# EAGLE design DALI_Master (EAGLE 6.2)
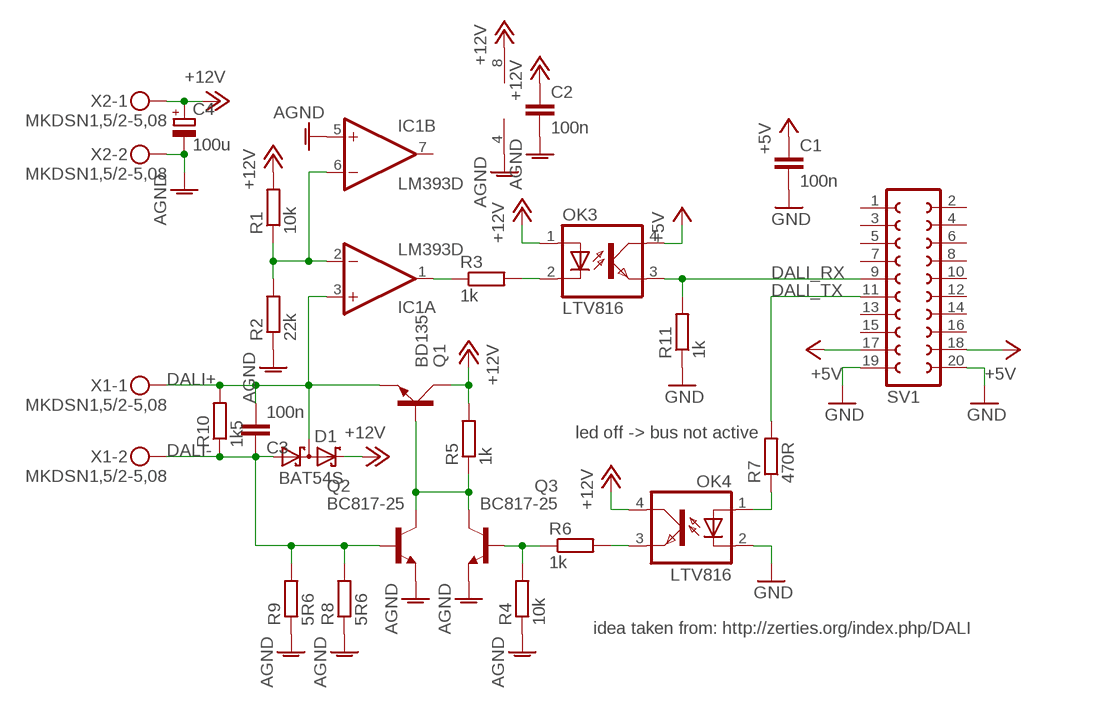
[diagram p0: schematic, sheet 1]

## Parts
C1  100n  C-EUC0805  [C0805]
C2  100n  C-EUC0805  [C0805]
C3  100n  C-EUC0805  [C0805]
C4  100u  CPOL-EUE2.5-6  [E2,5-6]
D1  BAT54S  [SOT23]
IC1  LM393D  [SO08]
OK3  LTV816  [DIL04]
OK4  LTV816  [DIL04]
Q1  BD135  BD139  [TO126AV]
Q2  BC817-25  BC817-25SMD  [SOT23-BEC]
Q3  BC817-25  BC817-25SMD  [SOT23-BEC]
R1  10k  R-EU_R0805  [R0805]
R2  22k  R-EU_R0805  [R0805]
R3  1k  R-EU_R0805  [R0805]
R4  10k  R-EU_R0805  [R0805]
R5  1k  R-EU_R0805  [R0805]
R6  1k  R-EU_R0805  [R0805]
R7  470R  R-EU_R0805  [R0805]
R8  5R6  R-EU_R1206  [R1206]
R9  5R6  R-EU_R1206  [R1206]
R10  1k5  R-EU_R0805  [R0805]
R11  1k  R-EU_R0805  [R0805]
SV1  FE10-2  [FE10-2]
X1  MKDSN1,5/2-5,08  [MKDSN1,5/2-5,08]
X2  MKDSN1,5/2-5,08  [MKDSN1,5/2-5,08]

## Nets
+5V: C1.1 OK3.4(COL) SV1.17 SV1.18
+12V: C2.1 C4.+ D1.2(C2) IC1.8(P:V+) OK3.1(A) OK4.4(COL) Q1.C R1.2 R5.2 X2.1
AGND: C2.2 C4.- IC1.4(P:V-) IC1.5(B:+IN) Q2.E Q3.E R2.1 R4.1 R8.1 R9.1 X2.2
DALI+: C3.2 D1.3(C1A2) IC1.3(A:+IN) Q1.E R10.2 X1.1
DALI-: C3.1 D1.1(A1) Q2.B R8.2 R9.2 R10.1 X1.2
DALI_RX: OK3.3(EMIT) R11.2 SV1.9
DALI_TX: R7.2 SV1.11
GND: C1.2 OK4.2(C) R11.1 SV1.19 SV1.20
N$2: IC1.1(A:OUT) R3.1
N$3: IC1.2(A:-IN) IC1.6(B:-IN) R1.1 R2.2
N$5: OK3.2(C) R3.2
N$6: Q3.B R4.2 R6.1
N$7: OK4.3(EMIT) R6.2
N$8: Q1.B Q2.C Q3.C R5.1
N$10: OK4.1(A) R7.1
Unconnected: IC1.7(B:OUT) SV1.1 SV1.2 SV1.3 SV1.4 SV1.5 SV1.6 SV1.7 SV1.8 SV1.10 SV1.12 SV1.13 SV1.14 SV1.15 SV1.16

## Notes on the sheet
- led off -> bus not active
- idea taken from: http://zerties.org/index.php/DALI

## Library data of the parts
C1-C3 = rcl:C-EU: CAPACITOR, European symbol
C4 = rcl:CPOL-EU: POLARIZED CAPACITOR, European symbol
D1 = diode:BAT54S: Schottky Diodes Pin connection corrected 2011-05-04 Source: Fairchild .. BAT54.pdf
IC1 = linear:LM393: COMPARATOR
OK3 OK4 = optocoupler:LTV816: OPTO COUPLER Source: LITEON, LTV816.pdf; OC_FARNELL: unknown; OC_NEWARK: unknown
Q1 = transistor-power:BD139: NPN TRANSISTOR
Q2 Q3 = transistor-npn:BC817*: NPN Transistor
R1-R11 = rcl:R-EU_: RESISTOR, European symbol
SV1 = con-lsta:FE10-2: FEMALE HEADER; OC_FARNELL: unknown; OC_NEWARK: unknown
X1 X2 = con-phoenix-508:MKDSN1,5/2-5,08: MKDSN 1,5/ 2-5,08 Printklemme Nennstrom: 13,5 A Nennspannung: 250 V Rastermaß: 5,08 mm Polzahl: 2 Anschlussart: Schraubanschluss Montage: Löten Anschlussrichtung Leiter/Platine: 0 ° Artikelnummer: 1729128 Source: http://eshop.phoenixcontact.com .. 1729128.pdf; MPN: MKDSN 1,5/2-5.08; OC_FARNELL: 1792903; OC_NEWARK: 30M2397

## Board
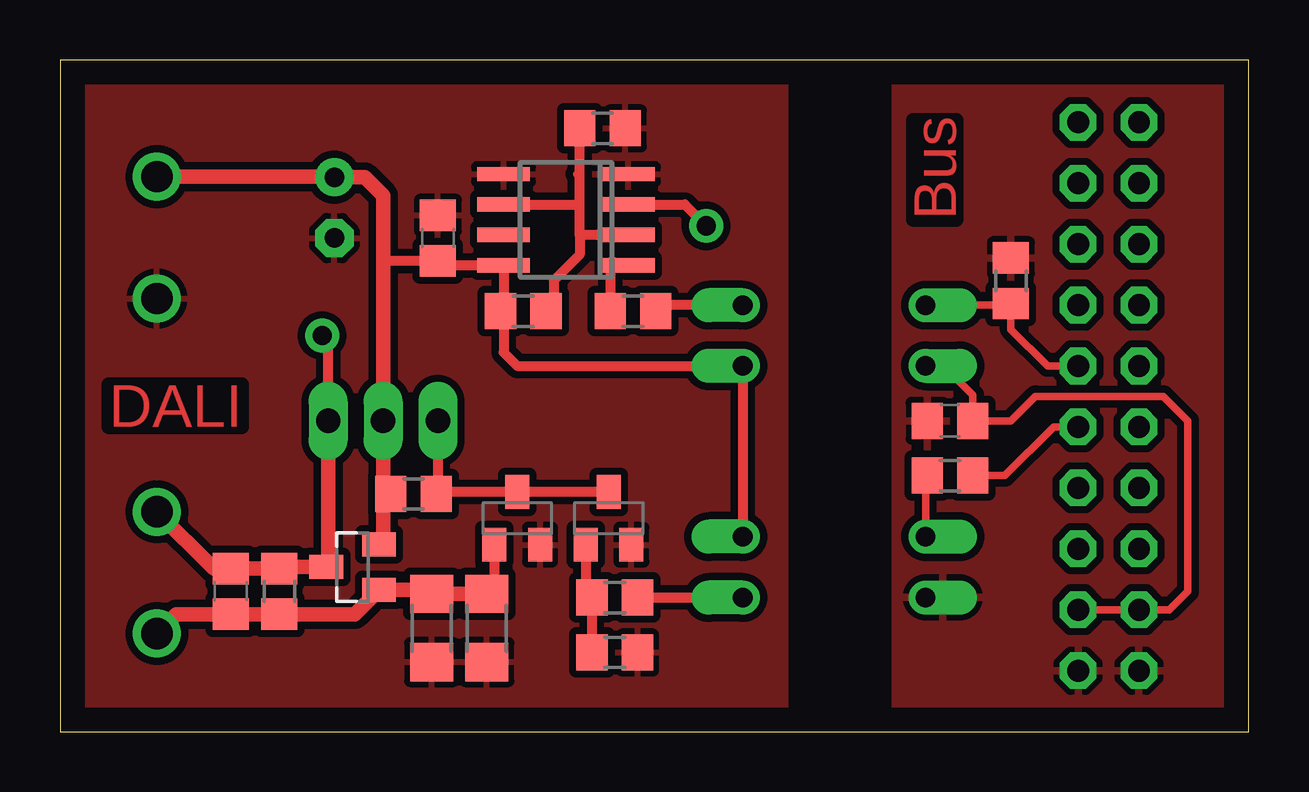
[diagram p1: board, top side]
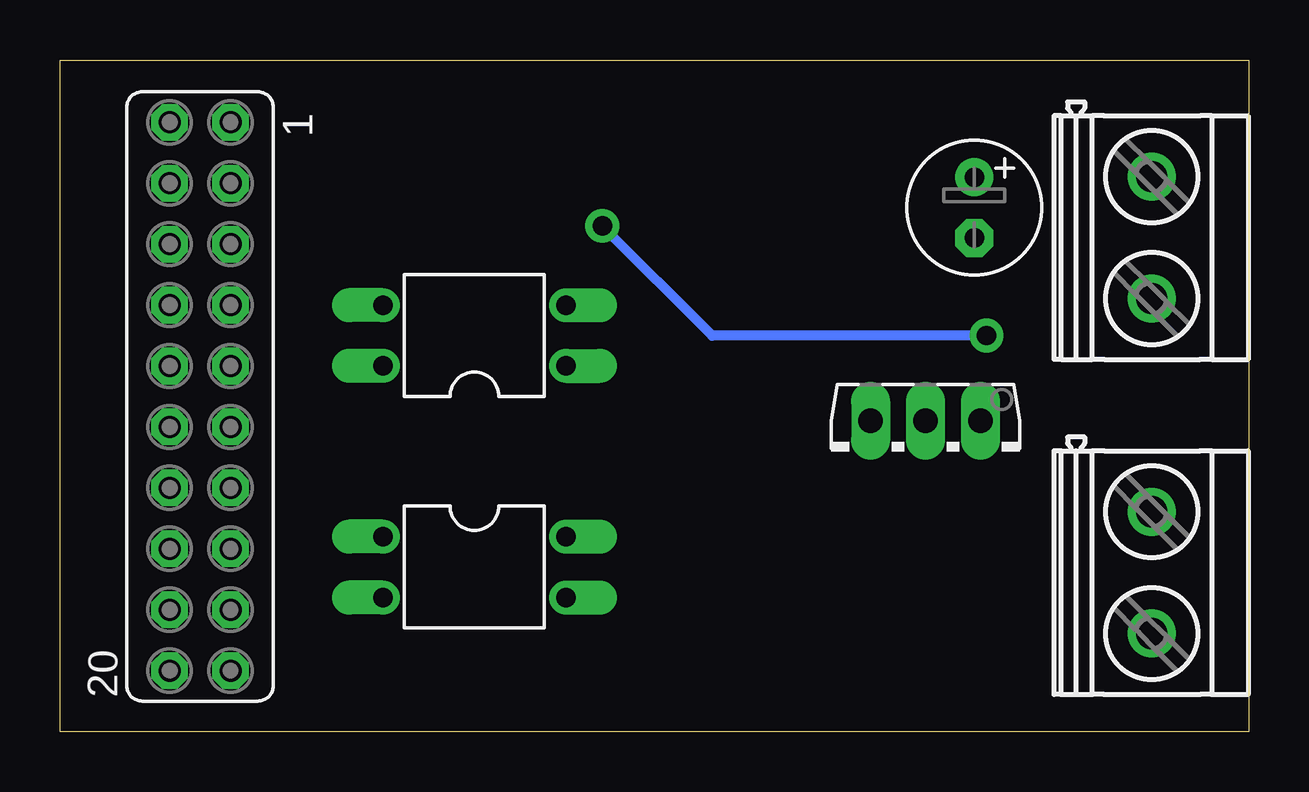
[diagram p2: board, bottom side, seen from below]

Size 49.52 x 28 mm. Coordinates in mm from the lower left corner, seen from the top.
Outline: 0,0 49.52,0 49.52,28 0,28 0,0
Copper layers (1*16): Top 0.035mm / dielectric 1.5mm / Bottom 0.035mm
Design rules: minimum track width 10mil, minimum drill 24mil, track to track 8mil, track to pad 8mil, pad to pad 8mil, via to via 8mil, smd to smd 8mil, copper to edge 40mil, drill to drill 8mil, minimum pad ring 12mil, minimum via ring 12mil, stop-mask expansion 4mil, vias tented up to drill 0mil, thermal gap 10mil

### Footprints (pad centres in the part's own frame; a part is rotated, then mirrored left to right if it is on the bottom)
C0805 = smd 1.3 x 1.5: 1 -0.95,0; 2 0.95,0
E2,5-6 = drill 0.813 pad 1.6: + -1.27,0 | drill 0.813 pad 1.6 octagon: - 1.27,0
SOT23 = smd 1 x 1.4: 1 -0.95,-1.1; 2 0.95,-1.1; 3 0,1.1
SO08 = smd 0.6 x 2.2: 1 -1.905,-2.6; 2 -0.635,-2.6; 3 0.635,-2.6; 4 1.905,-2.6; 5 1.905,2.6; 6 0.635,2.6; 7 -0.635,2.6; 8 -1.905,2.6
DIL04 = drill 0.813 offset: 1 -1.27,-3.81; 2 1.27,-3.81; 3 1.27,3.81; 4 -1.27,3.81
TO126AV = drill 1.016 long: B 2.286,-1.27; C 0,-1.27; E -2.286,-1.27
SOT23-BEC = smd 1 x 1.4: B -0.95,-1.1; C 0,1.1; E 0.95,-1.1
R0805 = smd 1.3 x 1.5: 1 -0.95,0; 2 0.95,0
R1206 = smd 1.6 x 1.803: 1 -1.422,0; 2 1.422,0
FE10-2 = drill 0.914 octagon: 1 -11.43,1.27; 2 -11.43,-1.27; 3 -8.89,1.27; 4 -8.89,-1.27; 5 -6.35,1.27; 6 -6.35,-1.27; 7 -3.81,1.27; 8 -3.81,-1.27; 9 -1.27,1.27; 10 -1.27,-1.27; 11 1.27,1.27; 12 1.27,-1.27; 13 3.81,1.27; 14 3.81,-1.27; 15 6.35,1.27; 16 6.35,-1.27; 17 8.89,1.27; 18 8.89,-1.27; 19 11.43,1.27; 20 11.43,-1.27
MKDSN1,5/2-5,08 = drill 1.3 pad 2: 1 -2.561,0.025; 2 2.519,0.025

### Placement (x,y rotation side)
C1  37.08,12.95 180 top
C2  15.75,20.57 90 top
C3  7.11,5.84 90 top
C4  11.43,21.84 270 bottom
D1  12.19,6.86 90 top
IC1  21.08,21.34 90 top
OK3  32.26,16.51 90 bottom
OK4  32.26,6.86 270 bottom
Q1  13.46,11.68 180 bottom
Q2  19.05,8.89 0 top
Q3  22.86,8.89 0 top
R1  19.3,17.53 180 top
R2  22.61,25.15 180 top
R3  23.88,17.53 0 top
R4  23.11,3.3 180 top
R5  14.73,9.91 180 top
R6  23.11,5.59 0 top
R7  37.08,10.67 0 top
R8  17.78,4.32 90 top
R9  15.49,4.32 90 top
R10  9.14,5.84 90 top
R11  39.62,18.8 270 top
SV1  43.69,13.97 270 bottom
X1  4.06,6.6 270 bottom
X2  4.06,20.57 270 bottom

### Tracks (layer width: path | path; a pad name or v marks a point on that pad's centre or on a via)
+5V
  Top 0.305: SV1.17 SV1.18 46.23,5.08 46.99,5.84 46.99,12.95 45.97,13.97 40.64,13.97 39.62,12.95 C1.1 38.03,14.04 36.83,15.24 OK3.4
+12V
  Top 0.406: 13.46,19.56 13.53,19.62 C2.1 15.94,19.43 IC1.8 18.48,17.65 | 18.48,17.65 R1.2 | 18.48,17.65 18.48,15.81 19.05,15.24 OK3.1 OK4.4
  Top 0.61: 13.72,9.91 13.46,9.65 13.46,7.98 D1.2 | R5.2 13.72,9.91 | 13.72,9.91 13.46,10.16 Q1.C 13.46,19.56 13.46,22.35 12.7,23.11 C4.+ 11.41,23.14 X2.1
AGND
  pour Top (isolate 0.305): -0.76,28.7 30.23,28.7 30.23,-0.76 -0.76,-0.76
DALI+  (via drill 0.8)
  Top 0.406: Q1.E 11.18,16.26 v10.92,16.51 | IC1.3 26.04,21.97 v26.92,21.08
  Top 0.61: 8.64,6.79 C3.2 6.41,6.79 X1.1 | 8.64,6.79 R10.2 | 8.64,6.79 8.64,6.86 D1.3 11.18,6.94 Q1.E
  Bottom 0.406: v10.92,16.51 22.35,16.51 v26.92,21.08
DALI-
  Top 0.406: Q2.B 18.1,6.06 R8.2
  Top 0.61: R8.2 R9.2 15.33,5.91 D1.1 12.28,4.89 R10.1 C3.1 4.85,4.89 X1.2
DALI_RX
  Top 0.305: SV1.9 41.15,15.24 39.62,16.76 R11.2 39.56,17.78 OK3.3
DALI_TX
  Top 0.305: R7.2 39.37,10.67 41.4,12.7 SV1.11
GND
  pour Top (isolate 0.305): 34.8,28.7 50.29,28.7 50.29,-0.76 34.8,-0.76
N$2
  Top 0.406: IC1.1 23.11,19.43 23.11,19.56 22.93,19.56 R3.1
N$3
  Top 0.305: 21.53,23.24 21.66,23.37
  Top 0.406: 21.66,20.7 21.66,21.97 | R2.2 21.66,23.37 21.66,22.1 21.66,21.97 | 21.66,20.7 21.66,19.88 20.57,18.8 20.57,17.85 R1.1 | IC1.2 21.66,20.7 | IC1.6 21.66,21.97
N$5
  Top 0.406: 25.08,17.78 R3.2 24.83,17.78 OK3.2
N$6
  Top 0.406: Q3.B 21.91,5.84 R6.1 R4.2
N$7
  Top 0.406: R6.2 OK4.3
N$8
  Top 0.406: Q3.C Q2.C 15.77,9.99 R5.1 15.75,9.97 Q1.B
N$10
  Top 0.305: OK4.1 36.07,10.6 R7.1

### Text on the board
Top: Bus | DALI